# Altium project Extendshield.PrjPcb
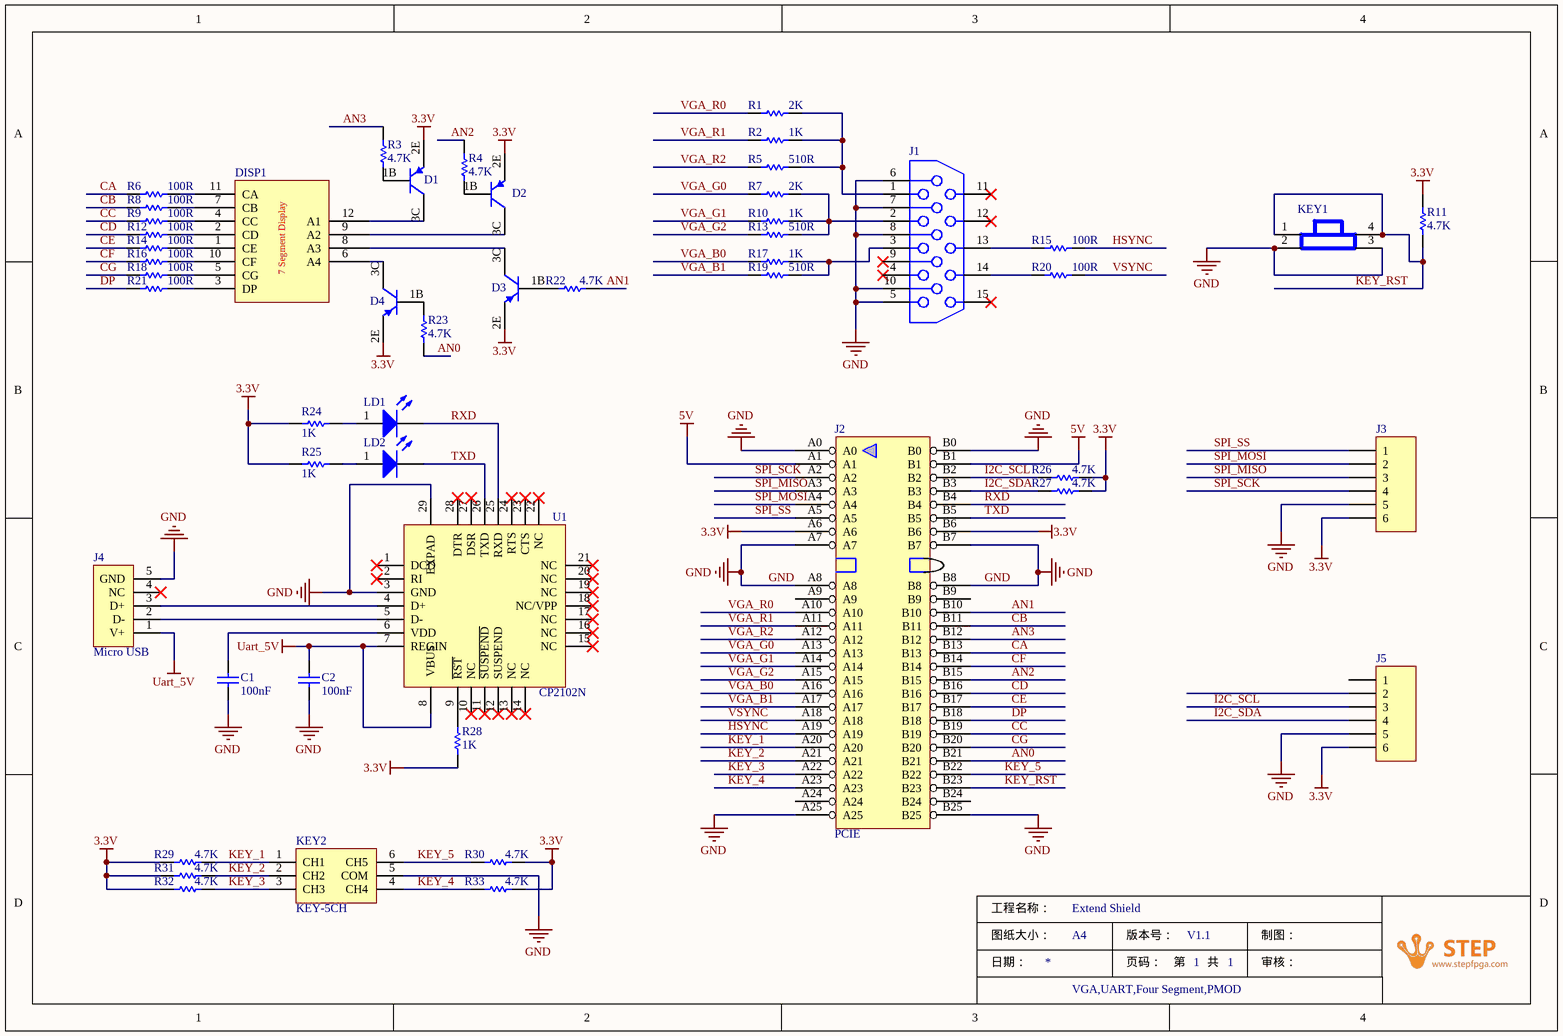
[diagram p0: Extendshield.SchDoc]
1 sheet, 50 parts. Net scope: global (net labels, ports and power ports of the same name join across sheets).
Board file: PCB1.PcbDoc

## Sheet Extendshield.SchDoc: Extend Shield
size A4; Revision: V1.1; SheetNumber: 1; SheetTotal: 1; Function: VGA,UART,Four Segment,PMOD

### Parts
C1  100nF  [C0603]
C2  100nF  [C0603]
D1  PNP  [SOT-23 s9013]  (value not drawn)
D2  PNP  [SOT-23 s9013]  (value not drawn)
D3  PNP  [SOT-23 s9013]  (value not drawn)
D4  PNP  [SOT-23 s9013]  (value not drawn)
DISP1  3641AH  [063Segment]  (value not drawn)
J1  DB15  [VGA_15pins]  (value not drawn)
J2  PCIE  [STEP_miniPCI-E]
J3  Header 6P  [PMOD_6_WS]  (value not drawn)
J4  Micro USB  [MICRO_USB_4]
J5  Header 6P  [PMOD_6_WS]  (value not drawn)
KEY1  CX20  [Button,4pins,white,smt]  (value not drawn)
KEY2  KEY-5CH  [button,five]
LD1  Red  [LED0603]  (value not drawn)
LD2  Red  [LED0603]  (value not drawn)
R1  2K  [R0603]
R2  1K  [R0603]
R3  4.7K  [R0603]
R4  4.7K  [R0603]
R5  510R  [R0603]
R6  100R  [R0603]
R7  2K  [R0603]
R8  100R  [R0603]
R9  100R  [R0603]
R10  1K  [R0603]
R11  4.7K  [R0603]
R12  100R  [R0603]
R13  510R  [R0603]
R14  100R  [R0603]
R15  100R  [R0603]
R16  100R  [R0603]
R17  1K  [R0603]
R18  100R  [R0603]
R19  510R  [R0603]
R20  100R  [R0603]
R21  100R  [R0603]
R22  4.7K  [R0603]
R23  4.7K  [R0603]
R24  1K  [R0603]
R25  1K  [R0603]
R26  4.7K  [R0603]
R27  4.7K  [R0603]
R28  1K  [R0603]
R29  4.7K  [R0603]
R30  4.7K  [R0603]
R31  4.7K  [R0603]
R32  4.7K  [R0603]
R33  4.7K  [R0603]
U1  CP2102N  [QFN5*5_28]

### Nets
3.3V: D1.2E(E) D2.2E(E) D3.2E(E) D4.2E(E) J2.A6 J2.B6 J3.6 J5.6 R11.1 R24.2 R25.2 R26.1 R27.1 R28.1 R29.2 R30.1 R31.2 R32.2 R33.1
5V: J2.A1 J2.B1
GND: C1.1 C2.1 J1.5 J1.6 J1.7 J1.8 J1.10 J2.A0 J2.A7 J2.A8 J2.A25 J2.B0 J2.B7 J2.B8 J2.B25 J3.5 J4.5(GND) J5.5 KEY1.2 KEY1.3 KEY2.5(COM) U1.3(GND) U1.29(EXPAD)
Uart_5V: C2.2 J4.1(V+) U1.7(REGIN) U1.8(VBUS)
AN0: J2.B21 R23.2
AN1: J2.B10 R22.1
AN2: J2.B15 R4.1
AN3: J2.B12 R3.1
CA: J2.B13 R6.1
CB: J2.B11 R8.1
CC: J2.B19 R9.1
CD: J2.B16 R12.1
CE: J2.B17 R14.1
CF: J2.B14 R16.1
CG: J2.B20 R18.1
DP: J2.B18 R21.1
HSYNC: J2.A19 R15.2
I2C_SCL: J2.B2 J5.3 R26.2
I2C_SDA: J2.B3 J5.4 R27.2
KEY_1: J2.A20 KEY2.1(CH1) R29.1
KEY_2: J2.A21 KEY2.2(CH2) R31.1
KEY_3: J2.A22 KEY2.3(CH3) R32.1
KEY_4: J2.A23 KEY2.4(CH4) R33.2
KEY_5: J2.B22 KEY2.6(CH5) R30.2
KEY_RST: J2.B23 KEY1.1 KEY1.4 R11.2
RXD: J2.B4 LD1.2(K) U1.25(RXD)
SPI_MISO: J2.A3 J3.3
SPI_MOSI: J2.A4 J3.2
SPI_SCK: J2.A2 J3.4
SPI_SS: J2.A5 J3.1
TXD: J2.B5 LD2.2(K) U1.26(TXD)
VGA_B0: J2.A16 R17.1
VGA_B1: J2.A17 R19.1
VGA_G0: J2.A13 R7.1
VGA_G1: J2.A14 R10.1
VGA_G2: J2.A15 R13.1
VGA_R0: J2.A10 R1.1
VGA_R1: J2.A11 R2.1
VGA_R2: J2.A12 R5.1
VSYNC: J2.A18 R20.2
NetC1_2: C1.2 U1.6(VDD)
NetD1_1B: D1.1B(B) R3.2
NetD1_3C: D1.3C(C) DISP1.12(A1)
NetD2_1B: D2.1B(B) R4.2
NetD2_3C: D2.3C(C) DISP1.9(A2)
NetD3_1B: D3.1B(B) R22.2
NetD3_3C: D3.3C(C) DISP1.8(A3)
NetD4_1B: D4.1B(B) R23.1
NetD4_3C: D4.3C(C) DISP1.6(A4)
NetDISP1_1: DISP1.1(CE) R14.2
NetDISP1_2: DISP1.2(CD) R12.2
NetDISP1_3: DISP1.3(DP) R21.2
NetDISP1_4: DISP1.4(CC) R9.2
NetDISP1_5: DISP1.5(CG) R18.2
NetDISP1_7: DISP1.7(CB) R8.2
NetDISP1_10: DISP1.10(CF) R16.2
NetDISP1_11: DISP1.11(CA) R6.2
NetJ1_1: J1.1 R1.2 R2.2 R5.2
NetJ1_2: J1.2 R7.2 R10.2 R13.2
NetJ1_3: J1.3 R17.2 R19.2
NetJ1_13: J1.13 R15.1
NetJ1_14: J1.14 R20.1
NetJ4_2: J4.2(D-) U1.5(D-)
NetJ4_3: J4.3(D+) U1.4(D+)
NetLD1_1: LD1.1(A) R24.1
NetLD2_1: LD2.1(A) R25.1
NetR28_2: R28.2 U1.9(~{RST})

Not connected (* = marked no-connect by the designer): J1 4* 9* 11* 12* 15*; J2 A9 A24 B9 B24; J4 4(NC)*; J5 1 2; U1 1(DCD)* 2(RI)* 10(NC)* 11(~{SUSPEND})* 12(SUSPEND)* 13(NC)* 14(NC)* 15(NC)* 16(NC)* 17(NC)* 18(NC/VPP)* 19(NC)* 20(NC)* 21(NC)* 22(NC)* 23(CTS)* 24(RTS)* 27(DSR)* 28(DTR)*

### Notes on the sheet
- 工程名称：
- 图纸大小：
- 日期：
- A4
- 版本号：
- 页码：
- 第
- 共
- 制图：
- 审核：
- (in symbol SEGMENT) 7 Segment Display

### Library data of the parts
C1 C2 = Cap Semi: Capacitor (Semiconductor SIM Model); Published: 8-Jun-2000; LatestRevisionDate: 29-May-2009; LatestRevisionNote: IPC-7351 Footprint Added.; PackageReference: C1206; Publisher: Altium Limited; PackageDescription: Chip Capacitor; Value: 100nF
D1-D4 = s9012: PNP三极管; Partnumber: s9012; Manufacturer: -; Value: PNP
DISP1 = SEGMENT: 0.36英寸 4位共阳极数码管; Value: 3641AH
J1 = VGA: VGA 插座 三排15针，90度弯角; Value: DB15
J2 = PCIE: Mini PCIE connector 52P; Value: PCIE
J3 J5 = Header 6: Header, 6P 单排排母; LatestRevisionDate: 17-Jul-2002; LatestRevisionNote: Re-released for DXP Platform.; Publisher: Altium Limited; Value: Header 6P
J4 = Micro USB Header: Micro USB B型插座 5P 牛角座; FootPrint: *; Part Number: *; Price: *; Manufacture: *; Value: Micro USB
KEY1 = KEY: 贴片4脚按键，3x4x2.5; Value: CX20
KEY2 = KEY_5ch: 贴片5向按键，7x7x5; Value: KEY-5CH
LD1 LD2 = LED: 贴片LED，0603，红色; Part Number: *; FootPrint: *; Value: Red; Manufacture: *
R1-R33 = Res1: Resistor; Published: 8-Jun-2000; LatestRevisionDate: 17-Jul-2002; LatestRevisionNote: Re-released for DXP Platform.; PackageReference: AXIAL-0.3; Publisher: Altium Limited; PackageDescription: Axial Device, Thru-Hole; 2 Leads; 0.3 in Pin Spacing
  R1 R7: Value: 2K
  R2 R10 R17 R24 R25 R28: Value: 1K
  R3 R4 R11 R22 R23 R26 R27 R29-R33: Value: 4.7K
  R5 R13 R19: Value: 510R
  R6 R8 R9 R12 R14-R16 R18 R20 R21: Value: 100R
U1 = CP2102: CP2102N，USB转UART芯片，QFN28; Value: CP2102N